# Altium schematic sheet MainBoard_V1p0_CON.SchDoc
size A4; SheetNumber: 6; SheetTotal: 8
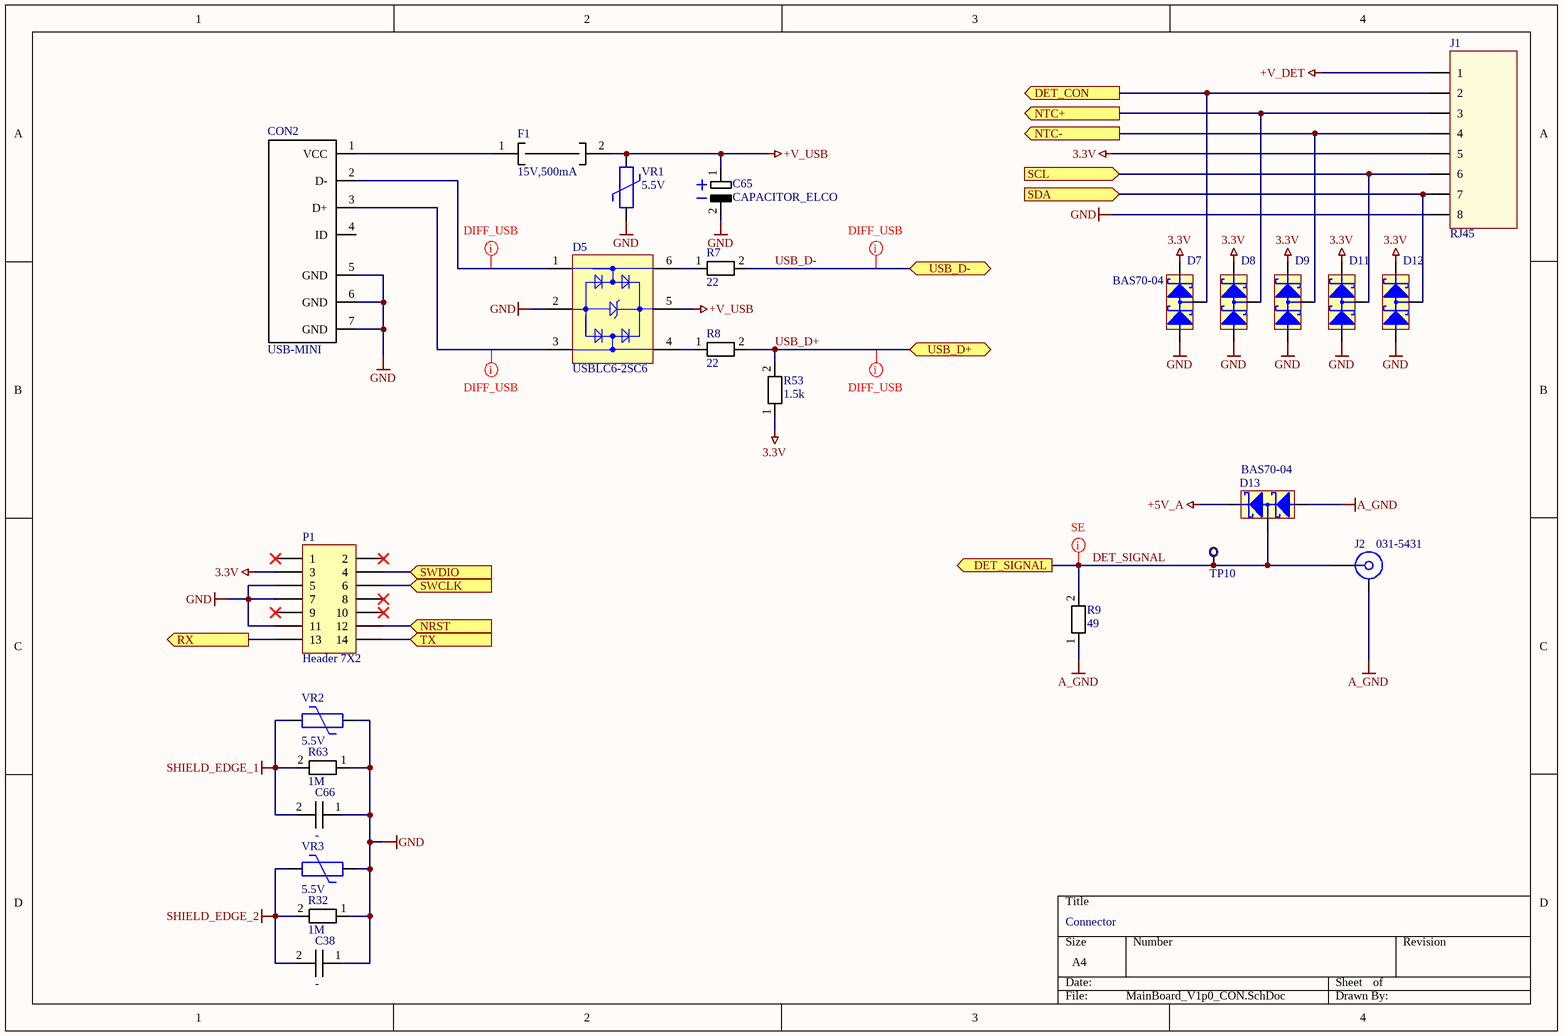
[diagram p0: MainBoard_V1p0_CON.SchDoc]

## Parts
C38  -  [0805_C]
C65  CAPACITOR_ELCO  [CAPAE9383X110M]
C66  -  [0805_C]
CON2  USB-MINI  [USB-MINI]
D5  USBLC6-2SC6  [STM-SOT23-6L_V]
D7  BAS70-04  [SOT23]
D8  BAS70-04  [SOT23]  (value not drawn)
D9  BAS70-04  [SOT23]  (value not drawn)
D11  BAS70-04  [SOT23]  (value not drawn)
D12  BAS70-04  [SOT23]  (value not drawn)
D13  BAS70-04  [SOT23]
F1  15V,500mA  [FUSE_1812L]
J1  RJ45  [RJ45_DEG90]
J2  031-5431  [CON_BNC_TE_ZDC]
P1  Header 7X2  [HDR2X7]
R7  22  [0805]
R8  22  [0805]
R9  49  [0805]
R32  1M  [0805]
R53  1.5k  [0805]
R63  1M  [0805]
TP10  ?  [PAD_40]  (value not drawn)  (no BOM)
VR1  5.5V  [0805]
VR2  5.5V  [0805]
VR3  5.5V  [0805]

## Ports
DET_CON (out), DET_SIGNAL (out), NRST (in), NTC+ (out), NTC- (out), RX (out), SCL (in), SDA (in), SWCLK (in), SWDIO (in), TX (in), USB_D+ (bidir), USB_D- (bidir)

## Nets
3.3V: D7.2 D8.2 D9.2 D11.2 D12.2 J1.5 P1.3 R53.1
+5V_A: D13.2
+V_DET: J1.1
+V_USB: C65.1 D5.5(VBUS) F1.2 VR1.2
A_GND: D13.1 J2.2,3,4(GND) R9.1
GND: C38.1 C65.2 C66.1 CON2.5(GND) CON2.6(GND) CON2.7(GND) D5.2(GND) D7.1 D8.1 D9.1 D11.1 D12.1 J1.8 P1.5 P1.7 P1.11 R32.1 R63.1 VR1.1 VR2.1 VR3.1
SHIELD_EDGE_1: C66.2 R63.2 VR2.2
SHIELD_EDGE_2: C38.2 R32.2 VR3.2
DET_CON: D7.3 J1.2 ; port DET_CON
DET_SIGNAL: D13.3 J2.1(SIGNAL) R9.2 TP10.1 ; port DET_SIGNAL
NRST: P1.12 ; port NRST
NTC+: D8.3 J1.3 ; port NTC+
NTC-: D9.3 J1.4 ; port NTC-
RX: P1.13 ; port RX
SCL: D11.3 J1.6 ; port SCL
SDA: D12.3 J1.7 ; port SDA
SWCLK: P1.6 ; port SWCLK
SWDIO: P1.4 ; port SWDIO
TX: P1.14 ; port TX
USB_D+: R8.2 R53.2 ; port USB_D+
USB_D-: R7.2 ; port USB_D-
NetCON2_1: CON2.1(VCC) F1.1
NetCON2_2: CON2.2(D-) D5.1(I/O_1)
NetCON2_3: CON2.3(D+) D5.3(I/O_2)
NetD5_4: D5.4(I/O_3) R8.1
NetD5_6: D5.6(I/O_4) R7.1

Not connected (* = marked no-connect by the designer): CON2 4(ID); P1 1* 2* 8* 9* 10*

## Layout directives
net class D90: NetCON2_2, NetCON2_3, USB_D+, USB_D-
net class SINGLE50: DET_SIGNAL

## Notes on the sheet
- Connector

## Library data of the parts
C38 C66 = CAPACITOR
D5 = USBLC6-2SC6: Very low capacitance ESD protection, 3.5 pF, -40 to 125 degC, 6-Pin SOT23, RoHS, Tape and Reel; Manufacturer: STMicroelectronics; Polarity: Uni-Directional; Clamping Voltage: 17V; Rad Hardened: No; Product Height (mm): 1.3mm; Leakage Current (Max): 0.15uA; Product Length (mm): 3.05mm; Number of Elements: 1; Peak Pulse Current: 5A; Configuration: Dual; Reverse Breakdown Voltage: 6V; Working Voltage (Max): 5V; Capacitance Value: 3.5pF; Suppressor Type: DiodeArrays; Product Depth (mm): 1.75mm; Test Current (It): 1mA; Package / Case: SOT-23; Operating Temperature Max Deg. C: 125C; Package Description: 6-Pin Small Outline Transistor, Body 2.925 x 1.625 mm, Pitch 0.95 mm; Package Reference: SOT23-6L; Datasheet Version: Rev. 5, 10/2011; Operating Temperature Min Deg. C: -40C; Mounting Style: SurfaceMount; Direction Type: Uni-Directional; Mounting: SurfaceMount; Pin Count: 6; Leakage Current: 0.15uA; Packaging: TapeandReel; Operating Temperature Classification: Automotive; Clamping Voltage (Max): 17V; Manufacturer URL: http://www.st.com/; Reverse Stand-off Voltage: 5V; Datasheet URL: http://www.st.com/st-web-ui/static/active/en/resource/technical/document/datasheet/CD00050750.pdf; Working Voltage: 5V; Operating Temp Range: -40Cto125C
F1 = FUSE
J1 = RJ45: 90 deg RJ45 connector, without transformer / 180 deg RJ45 connector without transformer
J2 = Amphenol 031-5431: 50R BNC Right Angle Jack, Amphenol 031-5431
P1 = Header 7X2: Header, 7-Pin, Dual row; LatestRevisionDate: 17-Jul-2002; LatestRevisionNote: Re-released for DXP Platform.; Publisher: Altium Limited
R7-R9 R32 R53 R63 = RESISTOR: Parameter 1: 10k
TP10 = TESTPOINT
VR1-VR3 = VARISTOR